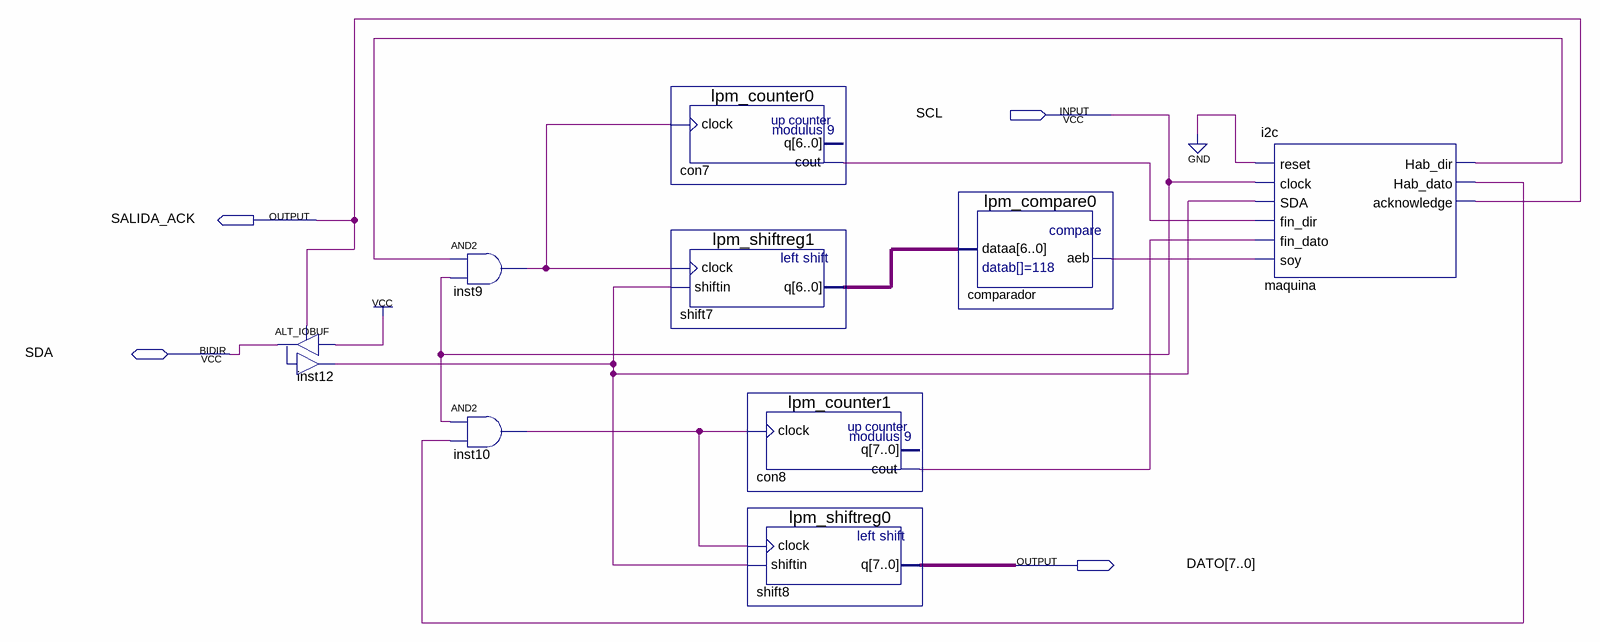
[diagram p0: schematic sheet]
// Quartus schematic i2cEsquematico.bdf as structural Verilog: 9 symbols, 4 pins
module i2cEsquematico (
  input  SCL,
  inout  SDA,
  output SALIDA_ACK,
  output [7:0] DATO
);

  wire comparador_aeb, con7_cout, con8_cout, inst9_out, inst10_out, inst12_o, maquina_hab_dato,
       maquina_hab_dir;
  wire [6:0] shift7_q;

  ALT_IOBUF inst12 (.i(1'b1), .oe(SALIDA_ACK), .o(inst12_o), .io(SDA));
  and inst9 (inst9_out, maquina_hab_dir, SCL);
  and inst10 (inst10_out, SCL, maquina_hab_dato);
  lpm_counter0 con7 (.clock(inst9_out), .cout(con7_cout));  // open: q
  lpm_shiftreg1 shift7 (.clock(inst9_out), .shiftin(inst12_o), .q(shift7_q));
  lpm_counter1 con8 (.clock(inst10_out), .cout(con8_cout));  // open: q
  lpm_shiftreg0 shift8 (.clock(inst10_out), .shiftin(inst12_o), .q(DATO));
  lpm_compare0 comparador (.dataa(shift7_q), .aeb(comparador_aeb));
  i2c maquina (
    .reset(1'b0), .clock(SCL), .SDA(inst12_o), .fin_dir(con7_cout), .fin_dato(con8_cout),
    .soy(comparador_aeb), .Hab_dir(maquina_hab_dir), .Hab_dato(maquina_hab_dato), .acknowledge(SALIDA_ACK));
endmodule
